# EAGLE schematic main_board (EAGLE 9.6.2)
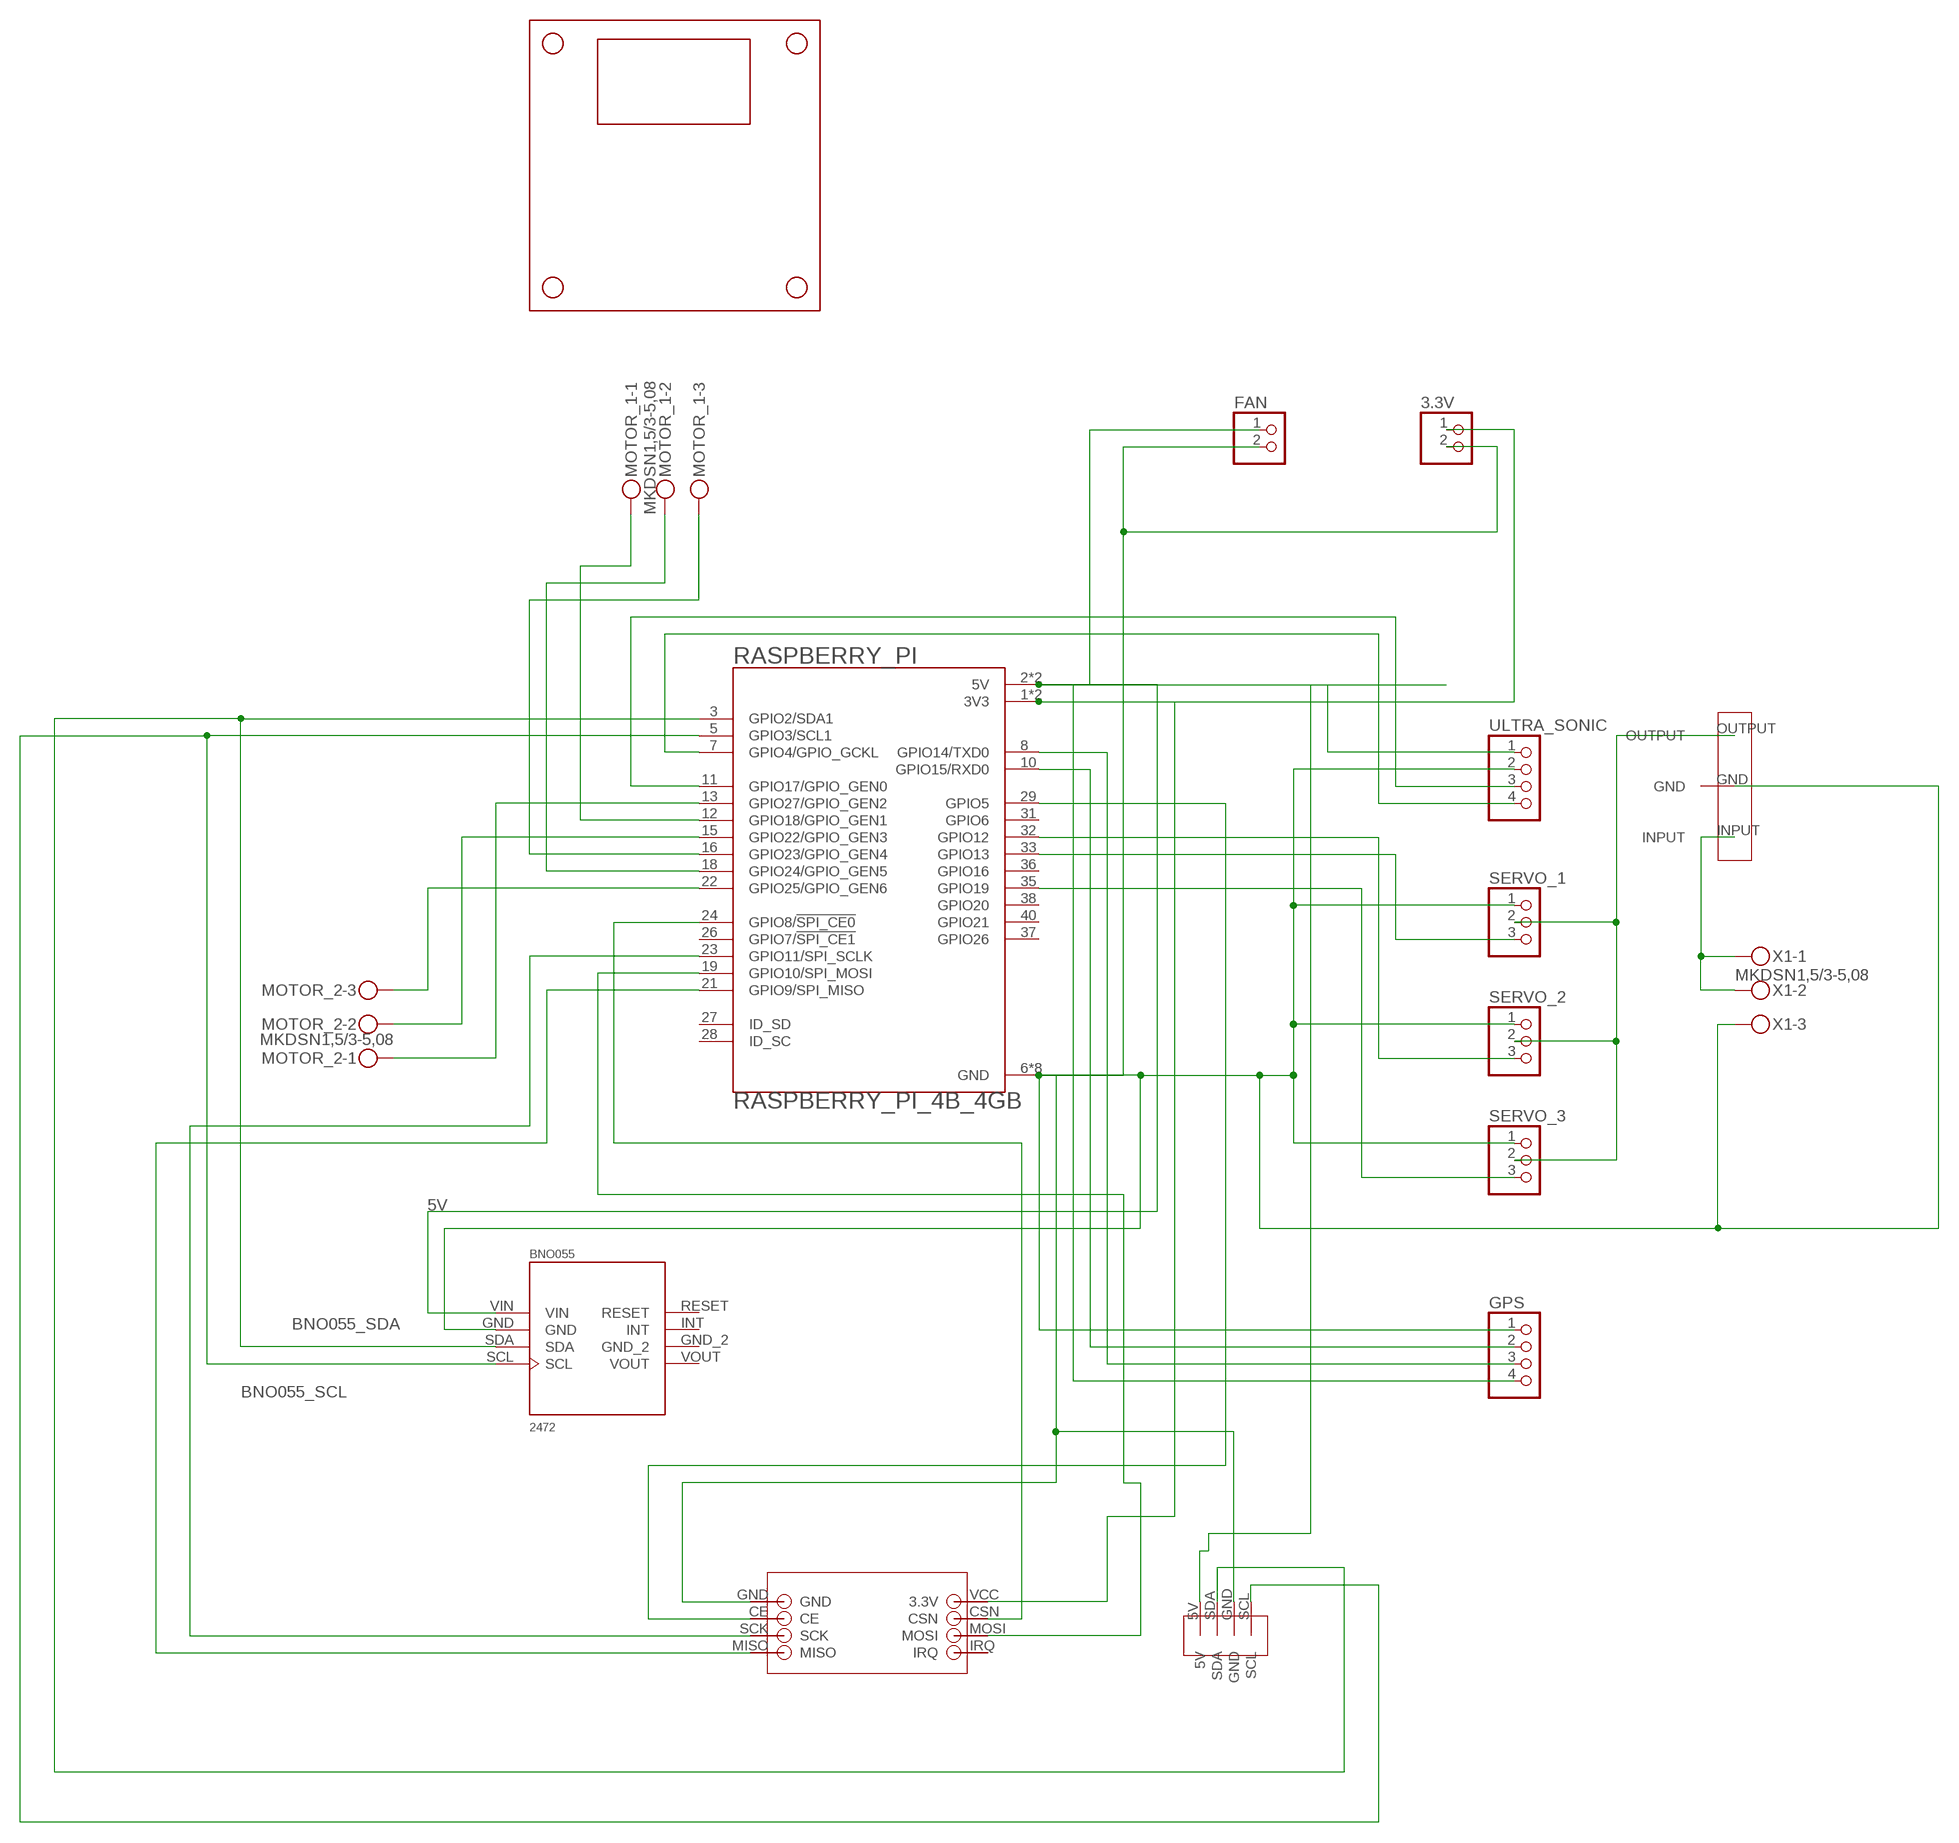
[diagram p0: schematic, sheet 1]

## Parts
3.3V  PINHD-1X2  [1X02]
BNO055  2472  [MODULE_2472]
FAN  PINHD-1X2  [1X02]
GPS  PINHD-1X4  [1X04]
L298N1  L298N_DRIVER  [L298N_DRIVER]
LXDC1  LXDC55  [LXDC55]
MOTOR_1  MKDSN1,5/3-5,08  [MKDSN1,5/3-5,08]
MOTOR_2  MKDSN1,5/3-5,08  [MKDSN1,5/3-5,08]
NRF24L1  NRF24L01  [NRF24L01]
RASPBERRY_PI  RASPBERRY_PI_4B_4GB  [MODULE_RASPBERRY_PI_4B_4GB]
SERVO_1  PINHD-1X3  [1X03]
SERVO_2  PINHD-1X3  [1X03]
SERVO_3  PINHD-1X3  [1X03]
U$1  DHT20  [DHT20]
ULTRA_SONIC  PINHD-1X4  [1X04]
X1  MKDSN1,5/3-5,08  [MKDSN1,5/3-5,08]

## Nets
3.3V [5V/3,3V/GND]: 3.3V.1 NRF24L1.VCC(3.3V) RASPBERRY_PI.1(3V3) RASPBERRY_PI.17(3V3)
5V [5V/3,3V/GND]: BNO055.VIN FAN.1 GPS.4 RASPBERRY_PI.2(5V) RASPBERRY_PI.4(5V) U$1.5V ULTRA_SONIC.1
5V_LXDC55 [5V_LXDC55]: LXDC1.OUTPUT SERVO_1.2 SERVO_2.2 SERVO_3.2
BATTERY+ [Battery]: LXDC1.INPUT X1.1 X1.2
BNO055_SCL: BNO055.SCL RASPBERRY_PI.5(GPIO3/SCL1) U$1.SCL
BNO055_SDA: BNO055.SDA RASPBERRY_PI.3(GPIO2/SDA1) U$1.SDA
CSN: NRF24L1.CSN RASPBERRY_PI.24(GPIO8/!SPI_CE0!)
ECHO: RASPBERRY_PI.7(GPIO4/GPIO_GCKL) ULTRA_SONIC.4
ENA: MOTOR_1.1 RASPBERRY_PI.12(GPIO18/GPIO_GEN1)
ENB: MOTOR_2.3 RASPBERRY_PI.22(GPIO25/GPIO_GEN6)
GND [5V/3,3V/GND]: 3.3V.2 BNO055.GND FAN.2 GPS.1 LXDC1.GND NRF24L1.GND RASPBERRY_PI.6(GND) RASPBERRY_PI.9(GND) RASPBERRY_PI.14(GND) RASPBERRY_PI.20(GND) RASPBERRY_PI.25(GND) RASPBERRY_PI.30(GND) RASPBERRY_PI.34(GND) RASPBERRY_PI.39(GND) SERVO_1.1 SERVO_2.1 SERVO_3.1 U$1.GND ULTRA_SONIC.2 X1.3
IN1: MOTOR_1.2 RASPBERRY_PI.18(GPIO24/GPIO_GEN5)
IN2: MOTOR_1.3 RASPBERRY_PI.16(GPIO23/GPIO_GEN4)
IN3: MOTOR_2.1 RASPBERRY_PI.13(GPIO27/GPIO_GEN2)
IN4: MOTOR_2.2 RASPBERRY_PI.15(GPIO22/GPIO_GEN3)
MISO: NRF24L1.MISO RASPBERRY_PI.21(GPIO9/SPI_MISO)
MOSI: NRF24L1.MOSI RASPBERRY_PI.19(GPIO10/SPI_MOSI)
NRF_CE_GPIO5: NRF24L1.CE RASPBERRY_PI.29(GPIO5)
RX: GPS.3 RASPBERRY_PI.8(GPIO14/TXD0)
SCK: NRF24L1.SCK RASPBERRY_PI.23(GPIO11/SPI_SCLK)
SERVO1_GPIO13: RASPBERRY_PI.33(GPIO13) SERVO_1.3
SERVO2_GPIO12: RASPBERRY_PI.32(GPIO12) SERVO_2.3
SERVO3_GPIO19: RASPBERRY_PI.35(GPIO19) SERVO_3.3
TRIG: RASPBERRY_PI.11(GPIO17/GPIO_GEN0) ULTRA_SONIC.3
TX: GPS.2 RASPBERRY_PI.10(GPIO15/RXD0)
Unconnected: BNO055.GND_2 BNO055.INT BNO055.RESET BNO055.VOUT NRF24L1.IRQ RASPBERRY_PI.26(GPIO7/!SPI_CE1!) RASPBERRY_PI.27(ID_SD) RASPBERRY_PI.28(ID_SC) RASPBERRY_PI.31(GPIO6) RASPBERRY_PI.36(GPIO16) RASPBERRY_PI.37(GPIO26) RASPBERRY_PI.38(GPIO20) RASPBERRY_PI.40(GPIO21)

## Library data of the parts
3.3V FAN = pinhead:PINHD-1X2: PIN HEADER
BNO055 = BNO055_IMU:2472: Check availability <https://pricing.snapeda.com/parts/2472/Adafruit/view-part?ref=eda>; AVAILABILITY: In Stock; CHECK_PRICES: https://www.snapeda.com/parts/2472/Adafruit+Industries/view-part/?ref=eda; DESCRIPTION: Adafruit 9-DOF Absolute Orientation IMU Fusion Breakout - BNO055 | Adafruit Industries 2472; MF: Adafruit; MP: 2472; PACKAGE: Non-Standard Adafruit; PRICE: None; PURCHASE-URL: https://www.snapeda.com/api/url_track_click_mouser/?unipart_id=6348449&manufacturer=Adafruit&part_name=2472&search_term=bno055; SNAPEDA_LINK: https://www.snapeda.com/parts/2472/Adafruit+Industries/view-part/?ref=snap
GPS ULTRA_SONIC = pinhead:PINHD-1X4: PIN HEADER
L298N1 = L298N_Motor_Driver:L298N_DRIVER
LXDC1 = LXDC55:LXDC55
MOTOR_1 MOTOR_2 X1 = con-phoenix-508:MKDSN1,5/3-5,08: MKDSN 1,5/ 3-5,08 Printklemme Nennstrom: 13,5 A Nennspannung: 250 V Rastermaß: 5,08 mm Polzahl: 3 Anschlussart: Schraubanschluss Montage: Löten Anschlussrichtung Leiter/Platine: 0 ° Artikelnummer: 1729131 Source: http://eshop.phoenixcontact.com .. 1729131.pdf
NRF24L1 = nRF24L01:NRF24L01
RASPBERRY_PI = RASPBERRY_PI_4B_4GB:RASPBERRY_PI_4B_4GB: Check availability <https://pricing.snapeda.com/parts/RASPBERRY%20PI%204B/4GB/Raspberry%20Pi/view-part?ref=eda>; AVAILABILITY: In Stock; CHECK_PRICES: https://www.snapeda.com/parts/RASPBERRY%20PI%204B/4GB/Raspberry+Pi/view-part/?ref=eda; DESCRIPTION: BCM2711 Raspberry Pi 4 Model B 4GB - ARM® Cortex®-A72 MPU Embedded Evaluation Board; MF: Raspberry Pi; MP: RASPBERRY PI 4B/4GB; PACKAGE: None; PRICE: None; SNAPEDA_LINK: https://www.snapeda.com/parts/RASPBERRY%20PI%204B/4GB/Raspberry+Pi/view-part/?ref=snap
SERVO_1-SERVO_3 = pinhead:PINHD-1X3: PIN HEADER
U$1 = DHT20:DHT20

## Net classes
0 default: width 0.4 mm, clearance 0.254 mm
1 5V/3,3V/GND: width 0.75 mm, clearance 0.381 mm
2 5V_LXDC55: width 2.5 mm, clearance 0.381 mm
3 Battery: width 2.5 mm, clearance 0.381 mm